# Altium schematic sheet DIGITAL.SchDoc: Panel
size 420 x 297 mm; Author: G.Kasprowicz; CompanyName: WUT ISE; DrawnBy: G.Kasprowicz; Organization: WUT ISE; Address1: PW ISE; Address2: Nowowiejska 15/19 00-665 Warsaw; Address3: gkasprow@gmail.com; DocumentNumber: 2; Revision: 2; SheetNumber: 2; SheetTotal: 3; ModifiedBy: -; CheckedDate: -; Title2: USB&JTAG; DivGrp: WUT ISE; Designer: G.Kasprowicz; ModifiedDate: -; ProjectName: Sensor Box
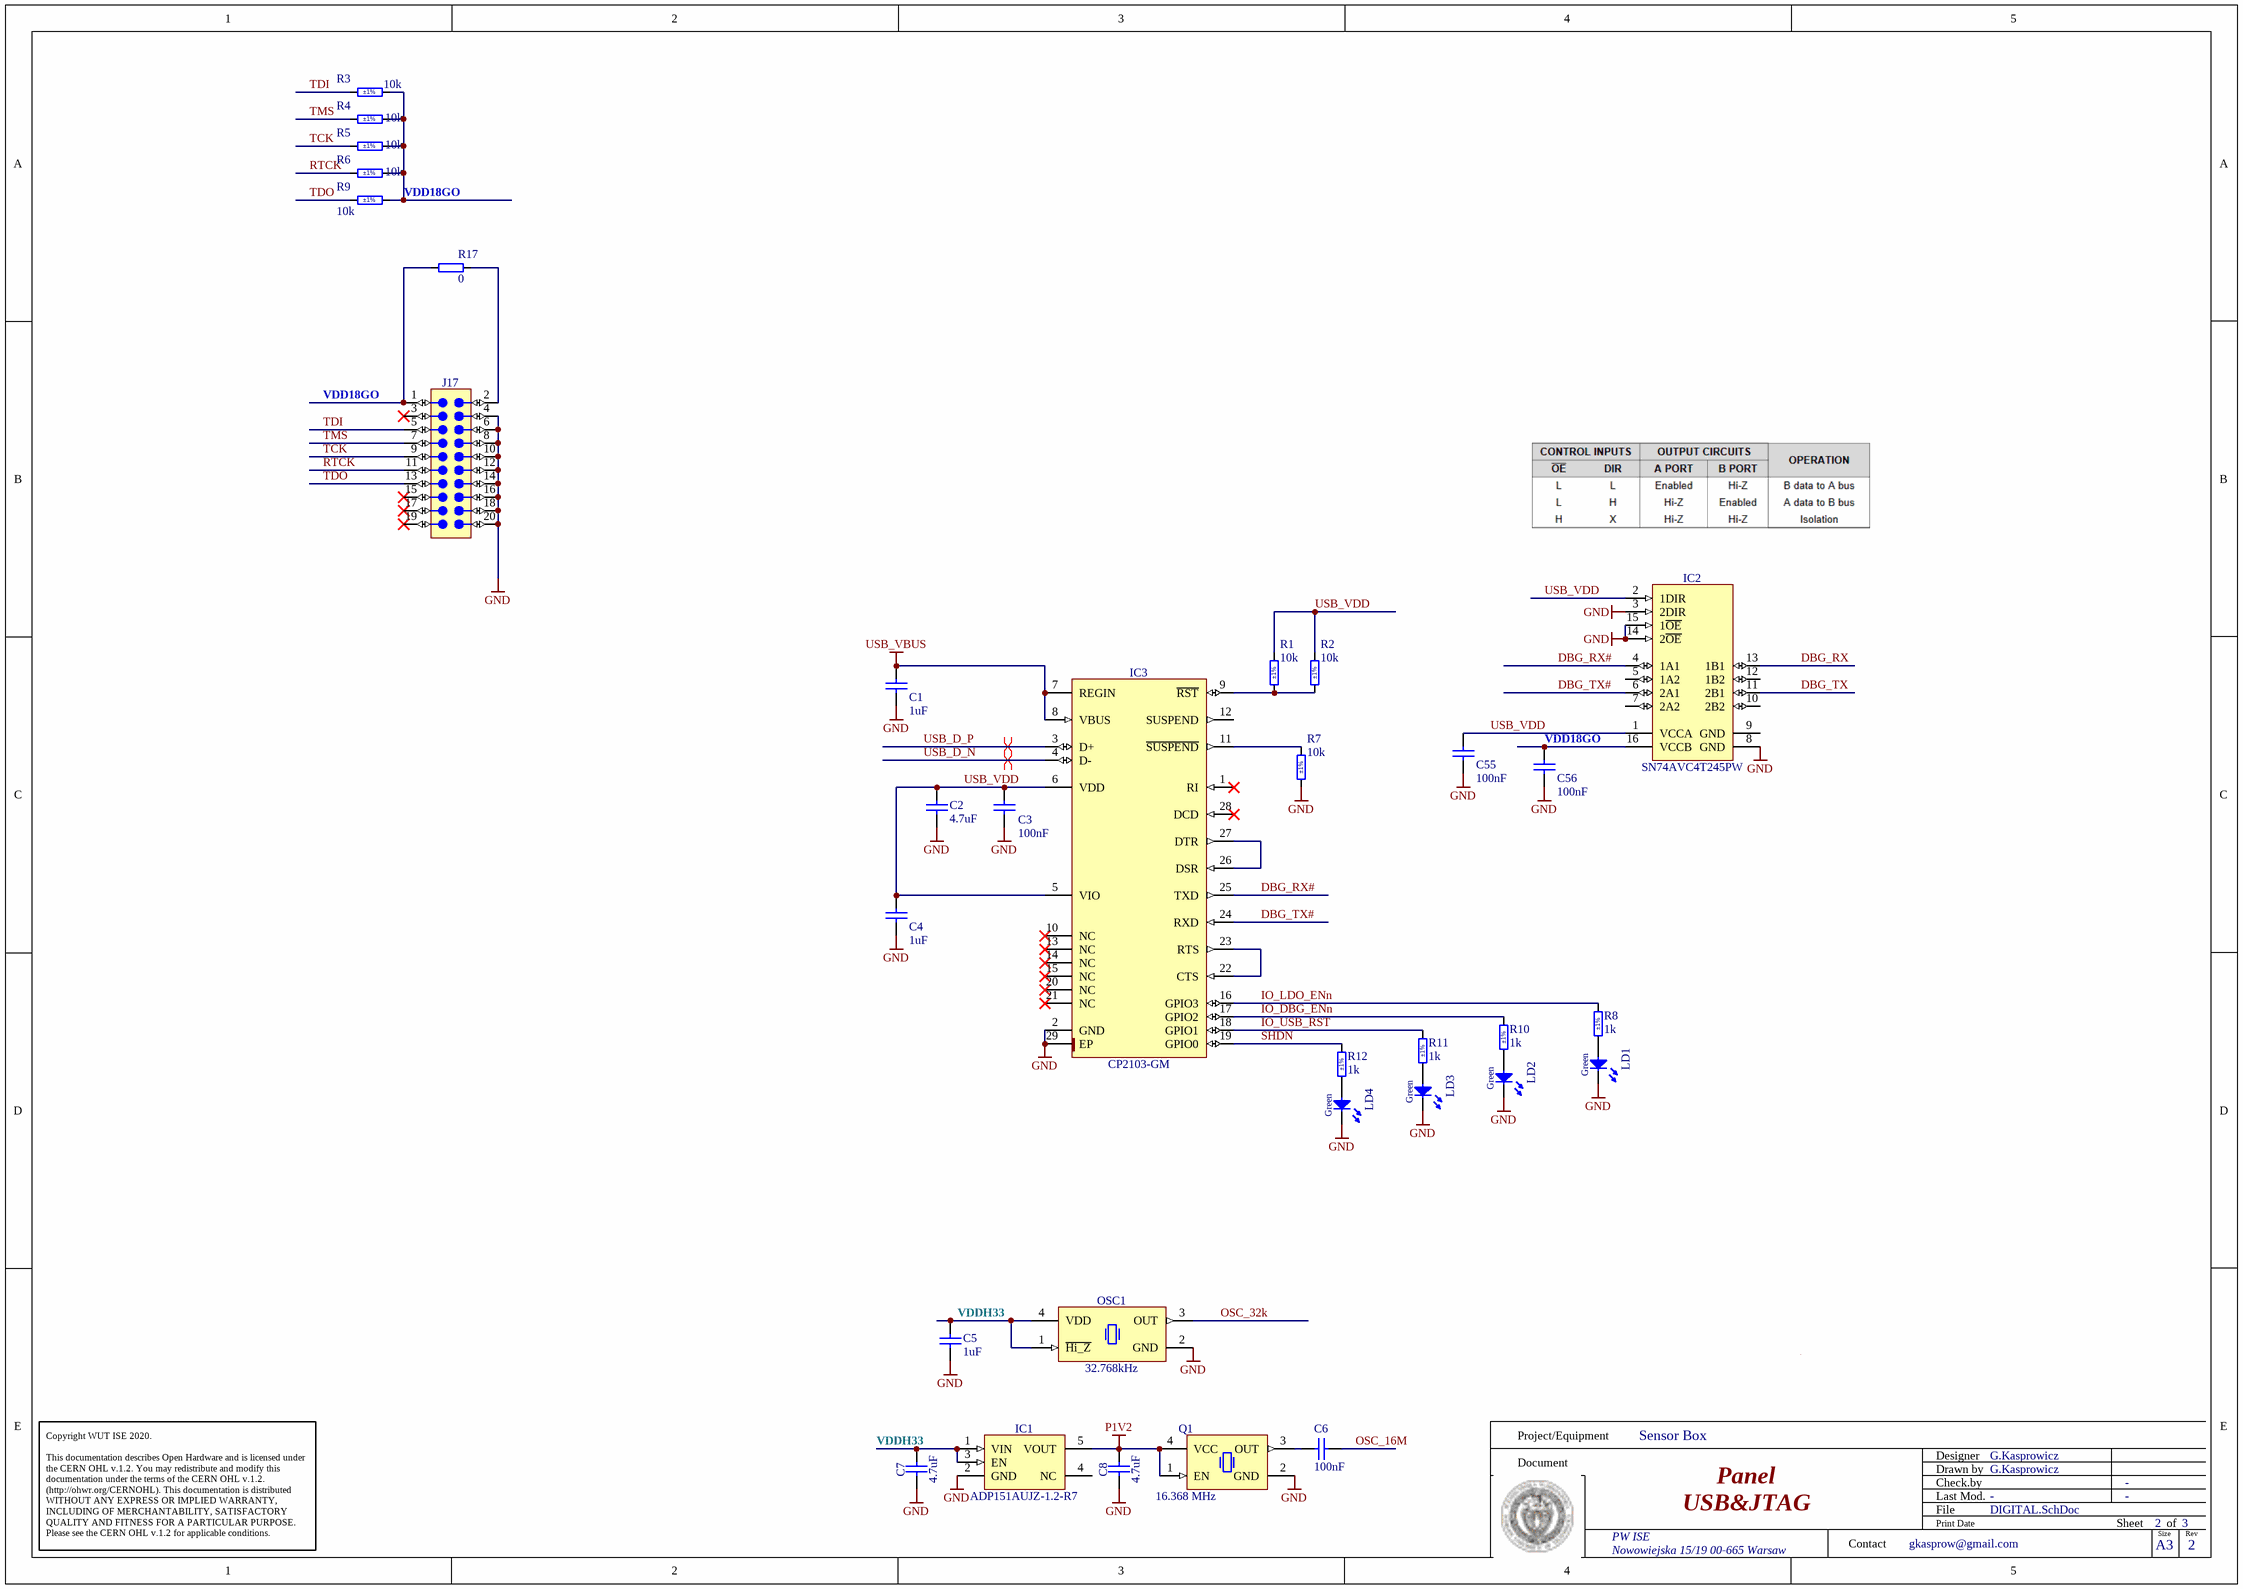
[diagram p0: DIGITAL.SchDoc]

## Parts
C1  1uF  [CAPC1005X55N]
C2  4.7uF  [CAPC1005X55N]
C3  100nF  [CAPC1005X55N]
C4  1uF  [CAPC1005X55N]
C5  1uF  [CAPC1005X55N]
C6  100nF  [CAPC1005X55N]
C7  4.7uF  [CAPC1005X55N]
C8  4.7uF  [CAPC1005X55N]
C55  100nF  [CAPC1005X55N]
C56  100nF  [CAPC1005X55N]
IC1  ADP151AUJZ-1.2-R7  [SOT95P280X90-5N]
IC2  SN74AVC4T245PW  [SOP65P640X120-16N]
IC3  CP2103-GM  [QFN50P500X500X100-29N-S335]
J17  Header 20  [SAMTEC_MTLW-110-07-L-D-250]  (value not drawn)
LD1  Green  [LED_KINGBRIGHT_KP-1608CGCK]
LD2  Green  [LED_KINGBRIGHT_KP-1608CGCK]
LD3  Green  [LED_KINGBRIGHT_KP-1608CGCK]
LD4  Green  [LED_KINGBRIGHT_KP-1608CGCK]
OSC1  32.768kHz  [OSC_ABRACON_ASE]
Q1  16.368 MHz  [XTAL_TXC_8Y]
R1  10k  Tolerance: ±1%  [RESC1005X40N]
R2  10k  Tolerance: ±1%  [RESC1005X40N]
R3  10k  Tolerance: ±1%  [RESC1005X40N]
R4  10k  Tolerance: ±1%  [RESC1005X40N]
R5  10k  Tolerance: ±1%  [RESC1005X40N]
R6  10k  Tolerance: ±1%  [RESC1005X40N]
R7  10k  Tolerance: ±1%  [RESC1005X40N]
R8  1k  Tolerance: ±1%  [RESC1005X40N]
R9  10k  Tolerance: ±1%  [RESC1005X40N]
R10  1k  Tolerance: ±1%  [RESC1005X40N]
R11  1k  Tolerance: ±1%  [RESC1005X40N]
R12  1k  Tolerance: ±1%  [RESC1005X40N]
R17  0  [RESC1005X40N]

## Nets
GND: C1.1 C2.2 C3.1 C4.1 C5.2 C7.1 C8.1 C55.1 C56.1 IC1.2(GND) IC2.3(2DIR) IC2.8(GND) IC2.14(2~{OE}) IC2.15(1~{OE}) IC3.2(GND) IC3.29(EP) J17.4 J17.6 J17.8 J17.10 J17.12 J17.14 J17.16 J17.18 J17.20 LD1.1(C) LD2.1(C) LD3.1(C) LD4.1(C) OSC1.2(GND) Q1.2(GND) R7.2
P1V2: C8.2 IC1.5(VOUT) Q1.1(EN) Q1.4(VCC)
USB_VBUS: C1.2 IC3.7(REGIN) IC3.8(VBUS)
DBG_RX: IC2.13(1B1)
DBG_RX#: IC2.4(1A1) IC3.25(TXD)
DBG_TX: IC2.11(2B1)
DBG_TX#: IC2.6(2A1) IC3.24(RXD)
IO_DBG_ENn: IC3.17(GPIO2) R10.2
IO_LDO_ENn: IC3.16(GPIO3) R8.2
IO_USB_RST: IC3.18(GPIO1) R11.2
OSC_16M: C6.2
OSC_32k: OSC1.3(OUT)
RTCK: J17.11 R6.1
SHDN: IC3.19(GPIO0) R12.2
TCK: J17.9 R5.1
TDI: J17.5 R3.1
TDO: J17.13 R9.1
TMS: J17.7 R4.1
USB_D_N: IC3.4(D-)
USB_D_P: IC3.3(D+)
USB_VDD: C2.1 C3.2 C4.2 C55.2 IC2.1(VCCA) IC2.2(1DIR) IC3.5(VIO) IC3.6(VDD) R1.1 R2.1
VDD18GO: C56.2 IC2.16(VCCB) J17.1 R3.2 R4.2 R5.2 R6.2 R9.2 R17.2
VDDH33: C5.1 C7.2 IC1.1(VIN) IC1.3(EN) OSC1.1(~{Hi_Z}) OSC1.4(VDD)
NetC6_1: C6.1 Q1.3(OUT)
NetIC3_9: IC3.9(~{RST}) R1.2 R2.2
NetIC3_11: IC3.11(~{SUSPEND}) R7.1
NetIC3_22: IC3.22(CTS) IC3.23(RTS)
NetIC3_26: IC3.26(DSR) IC3.27(DTR)
NetJ17_2: J17.2 R17.1
NetLD1_2: LD1.2(A) R8.1
NetLD2_2: LD2.2(A) R10.1
NetLD3_2: LD3.2(A) R11.1
NetLD4_2: LD4.2(A) R12.1

Not connected (* = marked no-connect by the designer): IC1 4(NC); IC2 5(1A2) 7(2A2) 9(GND) 10(2B2) 12(1B2); IC3 1(RI)* 10(NC)* 12(SUSPEND) 13(NC)* 14(NC)* 15(NC)* 20(NC)* 21(NC)* 28(DCD)*; J17 3* 15* 17* 19*

## Layout directives
differential pair: USB_D_N, USB_D_P

## Notes on the sheet
- Project/Equipment
- Document
- Designer
- Drawn by
- Check.by
- Copyright WUT ISE 2020.
  This documentation describes Open Hardware and is licensed under the CERN OHL v.1.2. You may redistribute and modify this documentation under the terms of the CERN OHL v.1.2. (http://ohwr.org/CERNOHL). This documentation is distributed WITHOUT ANY EXPRESS OR IMPLIED WARRANTY, INCLUDING OF MERCHANTABILITY, SATISFACTORY QUALITY AND FITNESS FOR A PARTICULAR PURPOSE. Please see the CERN OHL v.1.2 for applicable conditions.
- Contact
- File
- Last Mod.
- Print Date
- Sheet
- Size
- A3
- of
- Rev

## Library data of the parts
C1 C4 C5 = CC0402_1UF_16V_10%_X5R: Non-polarised capacitor; Part Description: SMD Multilayer Chip Ceramic Capacitor; Manufacturer: GENERIC; Manufacturer1 Part Number: C1005X5R1C105KT; Voltage: 16V; TC: X5R; Tolerance: ±10%; Value: 1uF; Part Number: CC0402_1UF_16V_10%_X5R; Component Kind: Standard; Component Type: Standard; Pin Count: 2; Status: Preferred; Manufacturer Part Number: CC0402_1UF_16V_10%_X5R; Case: 0402; Mounted: Yes; Socket: No; SMD: Yes; Sense: No; Manufacturer1 Example: TDK; Manufacturer1 ComponentHeight: 0.55mm; HelpURL: \\cern.ch\dfs\Applications\Altium\Datasheets\CC0402_X5R_TDK_C.pdf; Author: CERN DEM JLC; CreateDate: 25.10.2012; LatestRevisionDate: 25.10.2012
C2 C7 C8 = CC0402_4.7UF_10V_10%_X5R: Non-polarised capacitor; Part Description: SMD Multilayer Chip Ceramic Capacitor; Manufacturer: GENERIC; Manufacturer1 Part Number: C1005X5R1A475K050; Voltage: 10V; TC: X5R; Tolerance: ±10%; Value: 4.7uF; Part Number: CC0402_4.7UF_10V_10%_X5R; Component Kind: Standard; Component Type: Standard; Pin Count: 2; Status: Preferred; Manufacturer Part Number: CC0402_4.7UF_10V_10%_X5R; Case: 0402; Mounted: Yes; Socket: No; SMD: Yes; Sense: No; Manufacturer1 Example: TDK; Manufacturer1 ComponentHeight: 0.65mm; HelpURL: \\cern.ch\dfs\Applications\Altium\Datasheets\CC0402_X5R_TDK_C.pdf; Author: CERN DEM BC; CreateDate: 10.01.2020; LatestRevisionDate: 10.01.2020
C3 C6 C55 C56 = CC0402_100NF_16V_10%_X5R: Non-polarised capacitor; Part Description: SMD Multilayer Chip Ceramic Capacitor; Manufacturer: GENERIC; Manufacturer1 Part Number: GRM155R61C104KA88D; Voltage: 16V; TC: X5R; Tolerance: ±10%; Value: 100nF; Part Number: CC0402_100NF_16V_10%_X5R; Component Kind: Standard; Component Type: Standard; Pin Count: 2; Status: None; Manufacturer Part Number: CC0402_100NF_16V_10%_X5R; Case: 0402; Mounted: Yes; Socket: No; SMD: Yes; Sense: No; Manufacturer1 Example: MURATA; Manufacturer1 ComponentHeight: 0.55mm; HelpURL: \\cern.ch\dfs\Applications\Altium\Datasheets\CC0402_X5R_MURATA_GRM.pdf; Author: CERN DEM JLC; CreateDate: 10.12.2013; LatestRevisionDate: 10.12.2013
IC1 = ADP151AUJZ-1.2-R7: Ultralow Noise, 200 mA CMOS Linear Regulator; Part Description: 1.2V, 200mA, Ultralow Noise, CMOS Linear Regulator; Manufacturer: ANALOG DEVICES; PressFit: No; Bonding: No; Part Number: ADP151AUJZ-1.2-R7; Component Kind: Standard; Component Type: Standard; Device: ADP151AUJZ-1.2-R7; PackageDescription: SOT23, 0.95mm pitch; 5 pin, 1.75mm W X 3.00mm L, IPC Medium Density; Manufacturer Part Number: ADP151AUJZ-1.2-R7; Pin Count: 5; Case: SOT23; Mounted: Yes; Socket: No; SMD: Yes; Sense: No; ComponentHeight: 0.9mm; HelpURL: \\cern.ch\dfs\Applications\Altium\Datasheets\ADP151AUJZ-1.2-R7.pdf; Author: CERN DEM JLC; CreateDate: 21.11.2011; LatestRevisionDate: 19.06.2014
IC2 = SN74AVC4T245PW: 4-Bit Dual-Supply Bus Transceiver with Configurable Voltage Translation and 3-State Output; Part Description: 4-Bit Dual-Supply Bus Transceiver With Configurable Voltage Translation and 3-State Outputs; Manufacturer: TEXAS INSTRUMENTS; PressFit: No; Bonding: No; Part Number: SN74AVC4T245PW; Component Kind: Standard; Component Type: Standard; Device: SN74AVC4T245PW; PackageDescription: SOP, 0.65mm Pitch; 16 Pin, 4.40mm W X 5.00mm L X 1.20mm H body, IPC Medium Density; Manufacturer Part Number: SN74AVC4T245PW; Pin Count: 16; Case: TSSOP16; Mounted: Yes; Socket: No; SMD: Yes; Sense: No; ComponentHeight: 1.2mm; Author: CERN DEM JLC; HelpURL: \\cern.ch\dfs\Applications\Altium\Datasheets\SN74AVC4T245PW.pdf; CreateDate: 13.10.2011; LatestRevisionDate: 13.10.2011
IC3 = CP2103-GM: Single-Chip USB to UART Bridge; Manufacturer: SILICON LABS; PressFit: No; Bonding: No; Part Number: CP2103-GM; Component Kind: Standard; Component Type: Standard; Device: CP2103-GM; PackageDescription: QFN, 0.50mm Pitch, Square; 28 Pin, 5.00mm L X 5.00mm W X 1.00mm H body (w/Thermal Tab 3.35 X 3.35mm), IPC Medium Density; Part Description: Single-Chip USB to UART Bridge; Manufacturer Part Number: CP2103-GM; Pin Count: 29; Case: QFN28; Mounted: Yes; Socket: No; SMD: Yes; Sense: No; ComponentHeight: 1.0mm; Author: CERN DEM JLC; HelpURL: \\cern.ch\dfs\Applications\Altium\Datasheets\CP2103-GM.pdf; CreateDate: 17.08.2011; LatestRevisionDate: 17.08.2011
J17 = SAMTEC_MTLW-110-07-L-D-250: Connector 20 Male; Part Description: 20 Contacts, Pitch 2.54mm, Dual Row Through Mount Straight Header (Post Lead = 6.35mm, Tail Lead 3.05mm, Insulator 1.52mm); Manufacturer: SAMTEC; PressFit: No; Part Number: SAMTEC_MTLW-110-07-L-D-250; Component Kind: Standard; Component Type: Standard; Pin Count: 20; Family: Header 20; Mounted: Yes; Socket: No; SMD: No; Sense: No; Status: None; Manufacturer Part Number: MTLW-110-07-L-D-250; ComponentHeight: 7.87mm; HelpURL: \\cern.ch\dfs\Applications\Altium\Datasheets\SAMTEC_MTLW-110-07-L-D-250.pdf; Author: CERN DEM JLC; CreateDate: 22.01.2013; LatestRevisionDate: 22.01.2013
LD1-LD4 = LED_KINGBRIGHT_KP-1608CGCK: LED Green 1C 2A; Part Description: 1.6x0.8mm SMD Chip Green LED Lamp; PressFit: No; Bonding: No; Part Number: LED_KINGBRIGHT_KP-1608CGCK; Component Kind: Standard; Component Type: Standard; Color: Green; PackageDescription: SMT Green LED, Case 0603, Body L 1.60mm x W 0.80mm x H 1.10mm; Manufacturer: KINGBRIGHT; Manufacturer Part Number: KP-1608CGCK; Pin Count: 2; Case: 0603; Mounted: Yes; Socket: No; SMD: Yes; Sense: No; ComponentHeight: 1.1mm; HelpURL: \\cern.ch\dfs\Applications\Altium\Datasheets\LED_KINGBRIGHT_KP-1608CGCK.pdf; Author: CERN DEM HF; CreateDate: 01.10.2021; LatestRevisionDate: 01.10.2021
OSC1 = OSC_32.768kHz_ABRACON_ASEK-32.768KHz-LRT: Oscillator 32.768KHZ 25PPM 3.3V 3.2 x 2.5 x 1.2mm; PressFit: No; Bonding: No; Part Number: OSC_32.768kHz_ABRACON_ASEK-32.768KHz-LRT; Component Kind: Standard; Component Type: Standard; PackageDescription: SMD Oscillator, Body 3.20mm L X 2.50mm W X 1.20mm H, ASE Serie; Value: 32.768kHz; Part Description: Oscillator 32.768KHZ 25PPM 3.3V 3.2 x 2.5 x 1.2mm; Manufacturer: ABRACON; Manufacturer Part Number: ASEK-32.768KHz-LRT; Pin Count: 4; Mounted: Yes; Socket: No; SMD: Yes; Sense: No; ComponentHeight: 1.2mm; HelpURL: \\cern.ch\dfs\Applications\Altium\Datasheets\XTAL_ABRACON_ASE.pdf; Author: GK; CreateDate: 11.01.2022; LatestRevisionDate: 11.01.2022
Q1 = OSC_16.368 MHz _IQD_LFTCXO077226Cutt: 2.0 x 1.6mm SMD TCXO 16.368 MHz 0.5ppm 1.2V; Manufacturer: IQD; PressFit: No; Bonding: No; Part Number: OSC_16.368 MHz _IQD_LFTCXO077226Cutt; Component Kind: Standard; Component Type: Standard; PackageDescription: 4 Pins, 2x1.6X0.5mm, SMD Crystal oscillator; Value: 16.368 MHz; Part Description: 2.0 x 1.6mm SMD TCXO 16.368 MHz 0.5ppm 1.2V; Manufacturer Part Number: LFTCXO077226Cutt; Pin Count: 4; Mounted: Yes; Socket: No; SMD: Yes; Sense: No; ComponentHeight: 13.6mm; HelpURL: \\cern.ch\dfs\Applications\Altium\Datasheets\XTAL_TXC_8Y.pdf; Author: GK; CreateDate: 08.03.2012; LatestRevisionDate: 08.03.2012
R1-R7 R9 = R0402_10K_1%_0.0625W_100PPM: Resistor - 1%; Part Description: General Purpose Thick Film Chip Resistor; Manufacturer: GENERIC; Manufacturer1 Part Number: 232270671003L; TC: ±100ppm/°C; PressFit: No; Value: 10k; Part Number: R0402_10K_1%_0.0625W_100PPM; Component Kind: Standard; Component Type: Standard; Pin Count: 2; Status: Not Recommended; Power: 0.0625W; Manufacturer Part Number: R0402_10K_1%_0.0625W_100PPM; Case: 0402; Mounted: Yes; Sense: No; Socket: No; SMD: Yes; Manufacturer1 Example: YAGEO PHYCOMP; Manufacturer1 ComponentHeight: 0.4mm; HelpURL: \\cern.ch\dfs\Applications\Altium\Datasheets\R0402_Phycomp_RC0402.pdf; Author: CERN DEM JLC; CreateDate: 03.12.2007; LatestRevisionDate: 17.10.2012
R8 R10-R12 = R0402_1K_1%_0.0625W_100PPM: Resistor - 1%; Part Description: General Purpose Thick Film Chip Resistor; Manufacturer: GENERIC; Manufacturer1 Part Number: 232270671002L; TC: ±100ppm/°C; PressFit: No; Value: 1k; Part Number: R0402_1K_1%_0.0625W_100PPM; Component Kind: Standard; Component Type: Standard; Pin Count: 2; Status: Not Recommended; Power: 0.0625W; Manufacturer Part Number: R0402_1K_1%_0.0625W_100PPM; Case: 0402; Mounted: Yes; Sense: No; Socket: No; SMD: Yes; Manufacturer1 Example: YAGEO PHYCOMP; Manufacturer1 ComponentHeight: 0.4mm; HelpURL: \\cern.ch\dfs\Applications\Altium\Datasheets\R0402_Phycomp_RC0402.pdf; Author: CERN DEM JLC; CreateDate: 03.12.2007; LatestRevisionDate: 17.10.2012
R17 = R0402_0R_JUMPER: Resistor; Part Description: 1A (0.05R Max DC Resistance) Zero Ohm Jumper; Manufacturer: GENERIC; Manufacturer1 Part Number: 232270591001L; PressFit: No; Value: 0; Part Number: R0402_0R_JUMPER; Component Kind: Standard; Component Type: Standard; Pin Count: 2; Status: Not Recommended; Manufacturer Part Number: R0402_0R_JUMPER; Case: 0402; Mounted: Yes; Sense: No; Socket: No; SMD: Yes; Manufacturer1 Example: YAGEO PHYCOMP; Manufacturer1 ComponentHeight: 0.4mm; HelpURL: \\cern.ch\dfs\Applications\Altium\Datasheets\R0402_Phycomp_RC0402.pdf; Author: CERN DEM JLC; CreateDate: 03.12.2007; LatestRevisionDate: 17.10.2012